# EAGLE design BBB_CNC_V2 (EAGLE 6.6.0)

## Sheet 1 of 4
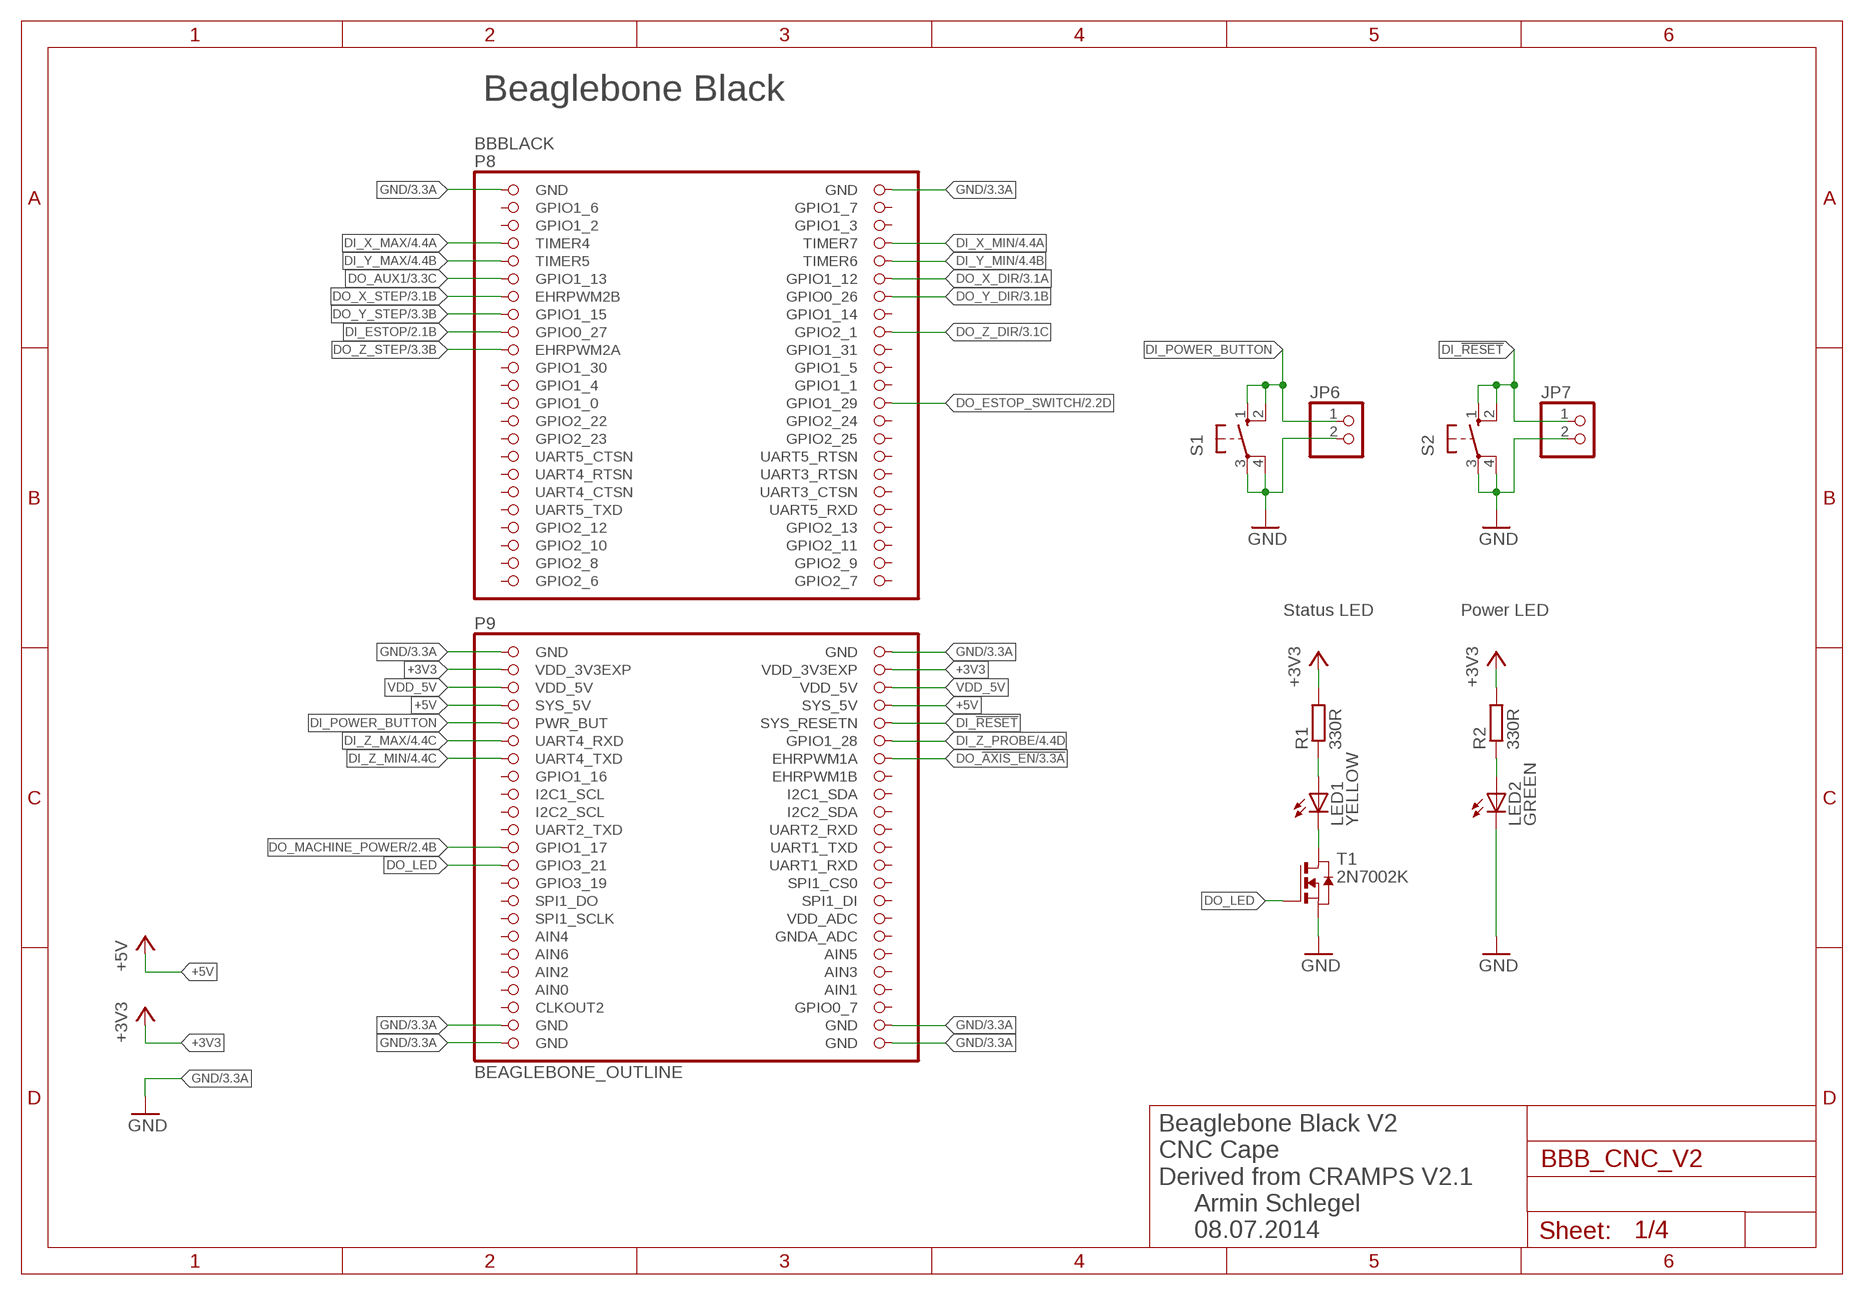
[diagram p0: schematic, sheet 1]

### Parts
BBBLACK  BEAGLEBONE_OUTLINE  [BEAGLEBONE_SHIELD]
JP6  PINHD-1X2  [1X02]
JP7  PINHD-1X2  [1X02]
LED1  YELLOW  LEDSML0805  [SML0805]
LED2  GREEN  LEDSML0805  [SML0805]
R1  330R  R-EU_R0603  [R0603]
R2  330R  R-EU_R0603  [R0603]
S1  10-XX  [B3F-10XX]
S2  10-XX  [B3F-10XX]
T1  2N7002K  NMOSSOT23  [SOT-23]

### Nets
+3V3: BBBLACK.49(VDD_3V3EXP) BBBLACK.50(VDD_3V3EXP) R1.2 R2.2 ; also sheet 2,4
+5V: BBBLACK.53(SYS_5V) BBBLACK.54(SYS_5V) ; also sheet 2,3
DI_!RESET: BBBLACK.56(SYS_RESETN) JP7.1 S2.1(S) S2.2(S1)
DI_ESTOP: BBBLACK.17(GPIO0_27) ; also sheet 2
DI_POWER_BUTTON: BBBLACK.55(PWR_BUT) JP6.1 S1.1(S) S1.2(S1)
DI_X_MAX: BBBLACK.7(TIMER4) ; also sheet 4
DI_X_MIN: BBBLACK.8(TIMER7) ; also sheet 4
DI_Y_MAX: BBBLACK.9(TIMER5) ; also sheet 4
DI_Y_MIN: BBBLACK.10(TIMER6) ; also sheet 4
DI_Z_MAX: BBBLACK.57(UART4_RXD) ; also sheet 4
DI_Z_MIN: BBBLACK.59(UART4_TXD) ; also sheet 4
DI_Z_PROBE: BBBLACK.58(GPIO1_28) ; also sheet 4
DO_!AXIS_EN: BBBLACK.60(EHRPWM1A) ; also sheet 3
DO_AUX1: BBBLACK.11(GPIO1_13) ; also sheet 3
DO_ESTOP_SWITCH: BBBLACK.26(GPIO1_29) ; also sheet 2
DO_LED: BBBLACK.71(GPIO3_21) T1.3(G)
DO_MACHINE_POWER: BBBLACK.69(GPIO1_17) ; also sheet 2
DO_X_DIR: BBBLACK.12(GPIO1_12) ; also sheet 3
DO_X_STEP: BBBLACK.13(EHRPWM2B) ; also sheet 3
DO_Y_DIR: BBBLACK.14(GPIO0_26) ; also sheet 3
DO_Y_STEP: BBBLACK.15(GPIO1_15) ; also sheet 3
DO_Z_DIR: BBBLACK.18(GPIO2_1) ; also sheet 3
DO_Z_STEP: BBBLACK.19(EHRPWM2A) ; also sheet 3
GND: BBBLACK.1(GND) BBBLACK.2(GND) BBBLACK.47(GND) BBBLACK.48(GND) BBBLACK.89(GND) BBBLACK.90(GND) BBBLACK.91(GND) BBBLACK.92(GND) JP6.2 JP7.2 LED2.C S1.3(P) S1.4(P1) S2.3(P) S2.4(P1) T1.2(S) ; also sheet 2,3,4
N$1: LED1.C T1.1(D)
N$2: LED1.A R1.1
N$3: LED2.A R2.1
VDD_5V: BBBLACK.51(VDD_5V) BBBLACK.52(VDD_5V)
Unconnected: BBBLACK.3(GPIO1_6) BBBLACK.4(GPIO1_7) BBBLACK.5(GPIO1_2) BBBLACK.6(GPIO1_3) BBBLACK.16(GPIO1_14) BBBLACK.20(GPIO1_31) BBBLACK.21(GPIO1_30) BBBLACK.22(GPIO1_5) BBBLACK.23(GPIO1_4) BBBLACK.24(GPIO1_1) BBBLACK.25(GPIO1_0) BBBLACK.27(GPIO2_22) BBBLACK.28(GPIO2_24) BBBLACK.29(GPIO2_23) BBBLACK.30(GPIO2_25) BBBLACK.31(UART5_CTSN) BBBLACK.32(UART5_RTSN) BBBLACK.33(UART4_RTSN) BBBLACK.34(UART3_RTSN) BBBLACK.35(UART4_CTSN) BBBLACK.36(UART3_CTSN) BBBLACK.37(UART5_TXD) BBBLACK.38(UART5_RXD) BBBLACK.39(GPIO2_12) BBBLACK.40(GPIO2_13) BBBLACK.41(GPIO2_10) BBBLACK.42(GPIO2_11) BBBLACK.43(GPIO2_8) BBBLACK.44(GPIO2_9) BBBLACK.45(GPIO2_6) BBBLACK.46(GPIO2_7) BBBLACK.61(GPIO1_16) BBBLACK.62(EHRPWM1B) BBBLACK.63(I2C1_SCL) BBBLACK.64(I2C1_SDA) BBBLACK.65(I2C2_SCL) BBBLACK.66(I2C2_SDA) BBBLACK.67(UART2_TXD) BBBLACK.68(UART2_RXD) BBBLACK.70(UART1_TXD) BBBLACK.72(UART1_RXD) BBBLACK.73(GPIO3_19) BBBLACK.74(SPI1_CS0) BBBLACK.75(SPI1_DO) BBBLACK.76(SPI1_DI) BBBLACK.77(SPI1_SCLK) BBBLACK.78(VDD_ADC) BBBLACK.79(AIN4) BBBLACK.80(GNDA_ADC) BBBLACK.81(AIN6) BBBLACK.82(AIN5) BBBLACK.83(AIN2) BBBLACK.84(AIN3) BBBLACK.86(AIN1) BBBLACK.87(CLKOUT2) BBBLACK.88(GPIO0_7)

### Notes on the sheet
- Beaglebone Black
- Status LED | Power LED
- Beaglebone Black V2
  CNC Cape
  Derived from CRAMPS V2.1
- Armin Schlegel
  08.07.2014

## Sheet 2 of 4
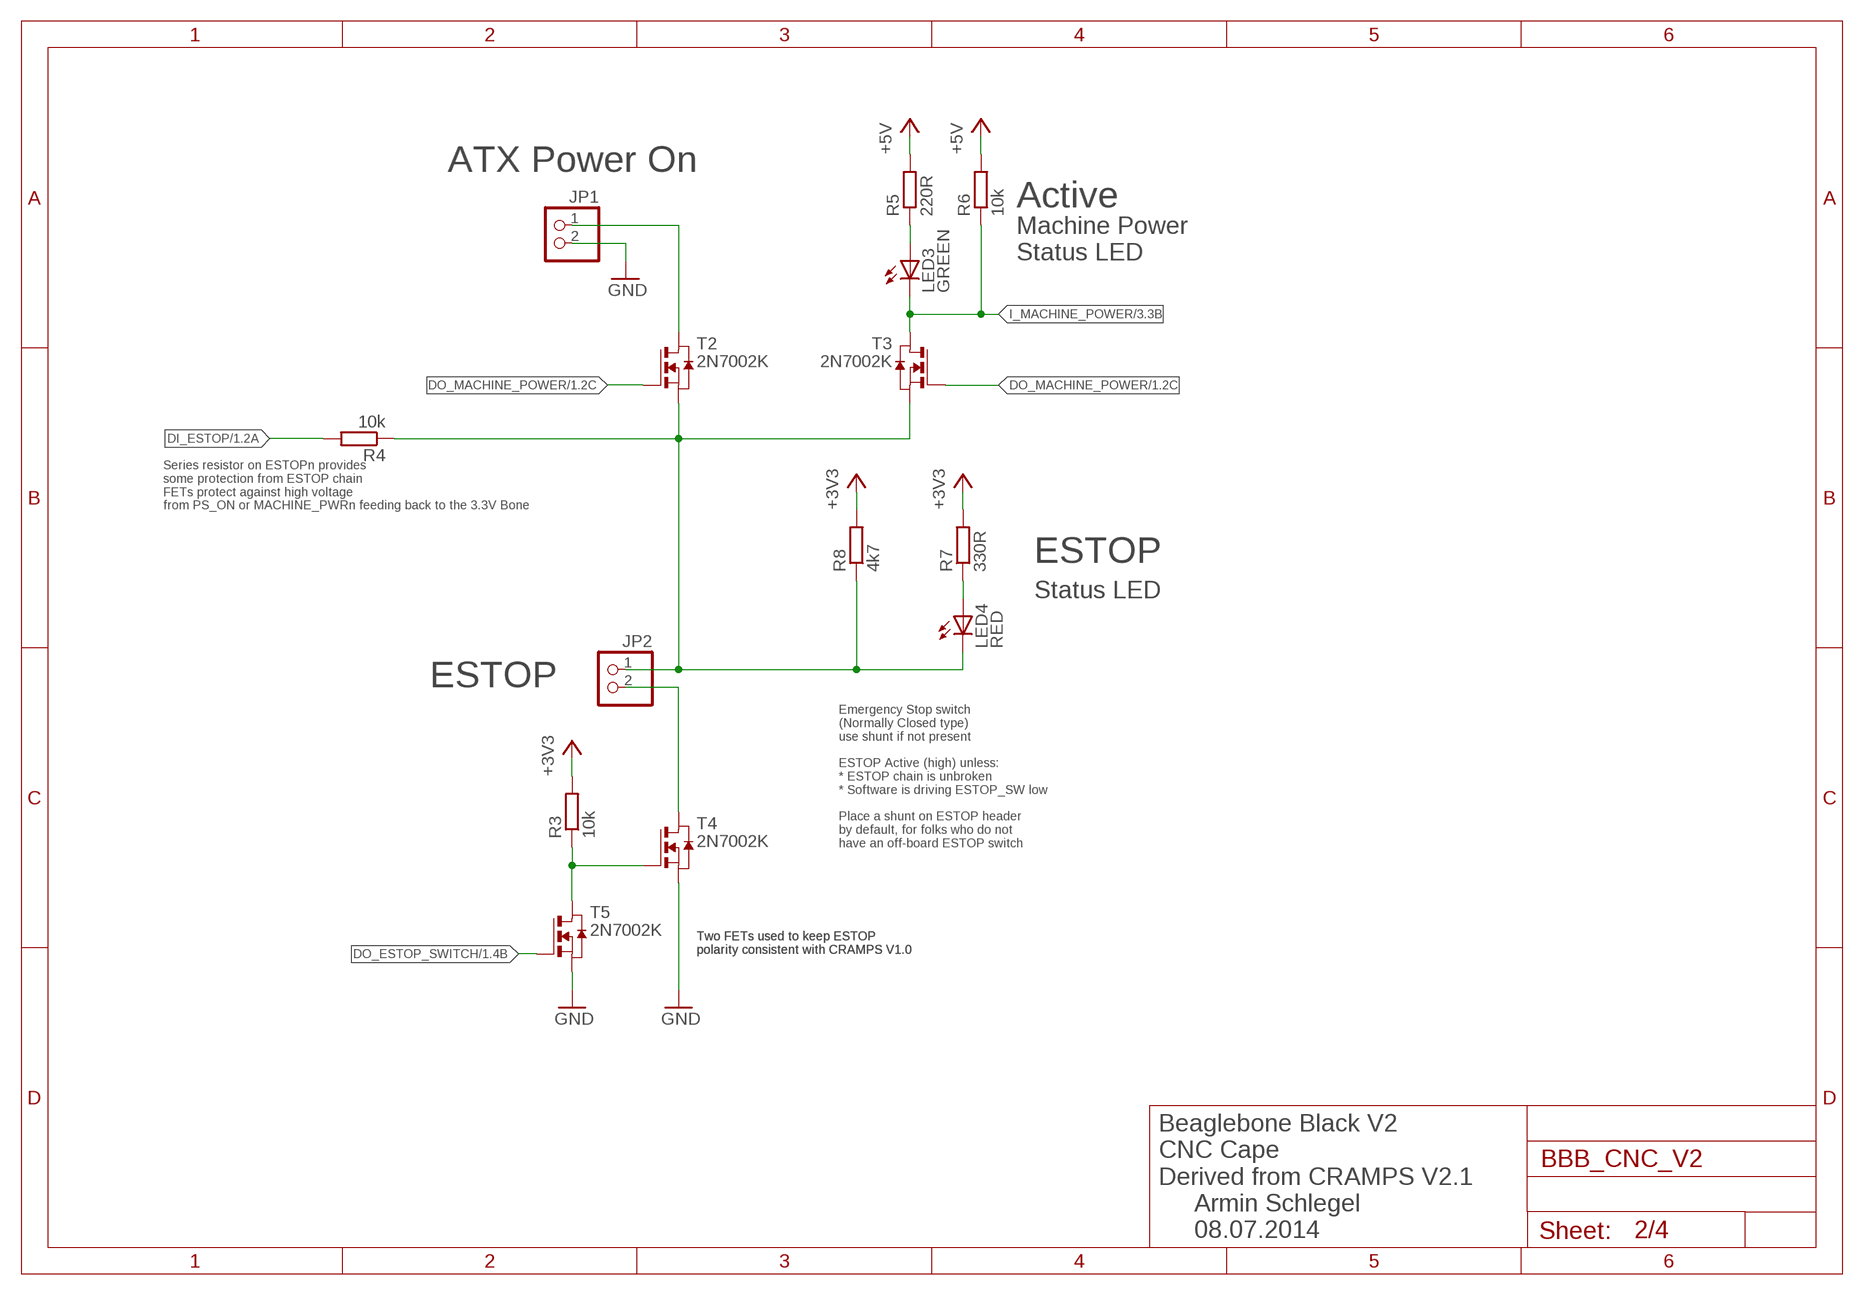
[diagram p1: schematic, sheet 2]

### Parts
JP1  PINHD-1X2  [1X02]
JP2  PINHD-1X2  [1X02]
LED3  GREEN  LEDSML0805  [SML0805]
LED4  RED  LEDSML0805  [SML0805]
R3  10k  R-EU_R0603  [R0603]
R4  10k  R-EU_R0603  [R0603]
R5  220R  R-EU_R0603  [R0603]
R6  10k  R-EU_R0603  [R0603]
R7  330R  R-EU_R0603  [R0603]
R8  4k7  R-EU_R0603  [R0603]
T2  2N7002K  NMOSSOT23  [SOT-23]
T3  2N7002K  NMOSSOT23  [SOT-23]
T4  2N7002K  NMOSSOT23  [SOT-23]
T5  2N7002K  NMOSSOT23  [SOT-23]

### Nets
+3V3: R3.2 R7.2 R8.2 ; also sheet 1,4
+5V: R5.2 R6.2 ; also sheet 1,3
DI_ESTOP: R4.2 ; also sheet 1
DO_ESTOP_SWITCH: T5.3(G) ; also sheet 1
DO_MACHINE_POWER: T2.3(G) T3.3(G) ; also sheet 1
GND: JP1.2 T4.2(S) T5.2(S) ; also sheet 1,3,4
I_MACHINE_POWER: LED3.C R6.1 T3.1(D) ; also sheet 3
I_MACHINE_POWER1: JP2.1 LED4.C R4.1 R8.1 T2.2(S) T3.2(S)
N$5: JP1.1 T2.1(D)
N$8: R3.1 T4.3(G) T5.1(D)
N$9: JP2.2 T4.1(D)
N$10: LED3.A R5.1
N$12: LED4.A R7.1

### Notes on the sheet
- ATX Power On
- Active
- Machine Power
  Status LED
- Series resistor on ESTOPn provides
  some protection from ESTOP chain
  FETs protect against high voltage
  from PS_ON or MACHINE_PWRn feeding back to the 3.3V Bone
- ESTOP
- Status LED
- ESTOP
- Emergency Stop switch
  (Normally Closed type)
  use shunt if not present
- ESTOP Active (high) unless:
  * ESTOP chain is unbroken
  * Software is driving ESTOP_SW low
- Place a shunt on ESTOP header
  by default, for folks who do not
  have an off-board ESTOP switch
- Two FETs used to keep ESTOP
  polarity consistent with CRAMPS V1.0
- Two FETs used to keep ESTOP
  polarity consistent with CRAMPS V1.0
- Beaglebone Black V2
  CNC Cape
  Derived from CRAMPS V2.1
- Armin Schlegel
  08.07.2014

## Sheet 3 of 4
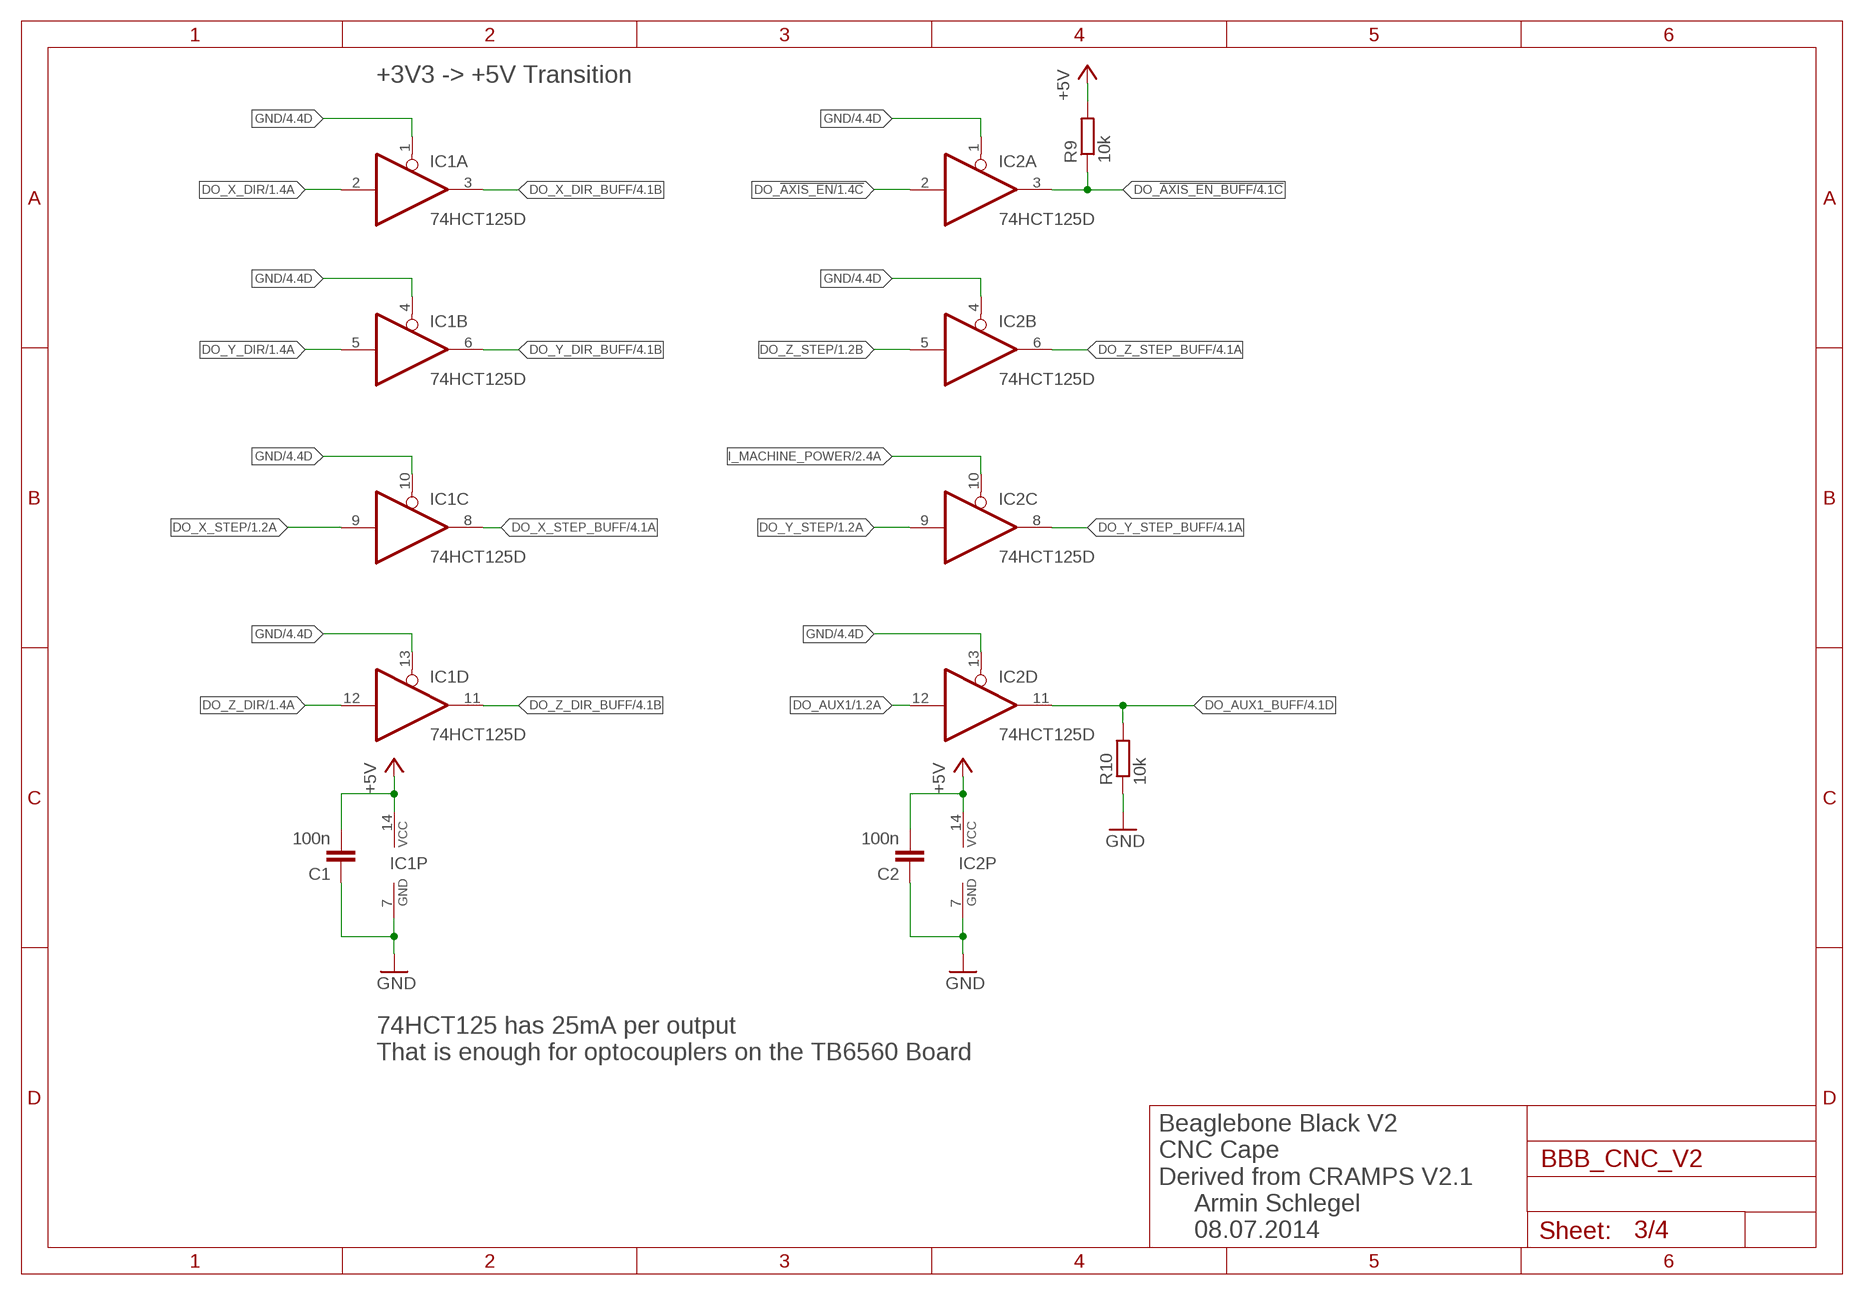
[diagram p2: schematic, sheet 3]

### Parts
C1  100n  C-EUC0603K  [C0603K]
C2  100n  C-EUC0603K  [C0603K]
IC1  74HCT125D  [SO14]
IC2  74HCT125D  [SO14]
R9  10k  R-EU_R0603  [R0603]
R10  10k  R-EU_R0603  [R0603]

### Nets
+5V: C1.2 C2.2 IC1.14(P:VCC) IC2.14(P:VCC) R9.2 ; also sheet 1,2
DO_!AXIS_EN: IC2.2(A:I) ; also sheet 1
DO_!AXIS_EN_BUFF: IC2.3(A:O) R9.1 ; also sheet 4
DO_AUX1: IC2.12(D:I) ; also sheet 1
DO_AUX1_BUFF: IC2.11(D:O) R10.2 ; also sheet 4
DO_X_DIR: IC1.2(A:I) ; also sheet 1
DO_X_DIR_BUFF: IC1.3(A:O) ; also sheet 4
DO_X_STEP: IC1.9(C:I) ; also sheet 1
DO_X_STEP_BUFF: IC1.8(C:O) ; also sheet 4
DO_Y_DIR: IC1.5(B:I) ; also sheet 1
DO_Y_DIR_BUFF: IC1.6(B:O) ; also sheet 4
DO_Y_STEP: IC2.9(C:I) ; also sheet 1
DO_Y_STEP_BUFF: IC2.8(C:O) ; also sheet 4
DO_Z_DIR: IC1.12(D:I) ; also sheet 1
DO_Z_DIR_BUFF: IC1.11(D:O) ; also sheet 4
DO_Z_STEP: IC2.5(B:I) ; also sheet 1
DO_Z_STEP_BUFF: IC2.6(B:O) ; also sheet 4
GND: C1.1 C2.1 IC1.1(A:OE) IC1.4(B:OE) IC1.7(P:GND) IC1.10(C:OE) IC1.13(D:OE) IC2.1(A:OE) IC2.4(B:OE) IC2.7(P:GND) IC2.13(D:OE) R10.1 ; also sheet 1,2,4
I_MACHINE_POWER: IC2.10(C:OE) ; also sheet 2

### Notes on the sheet
- +3V3 -> +5V Transition
- 74HCT125 has 25mA per output
  That is enough for optocouplers on the TB6560 Board
- Beaglebone Black V2
  CNC Cape
  Derived from CRAMPS V2.1
- Armin Schlegel
  08.07.2014

## Sheet 4 of 4
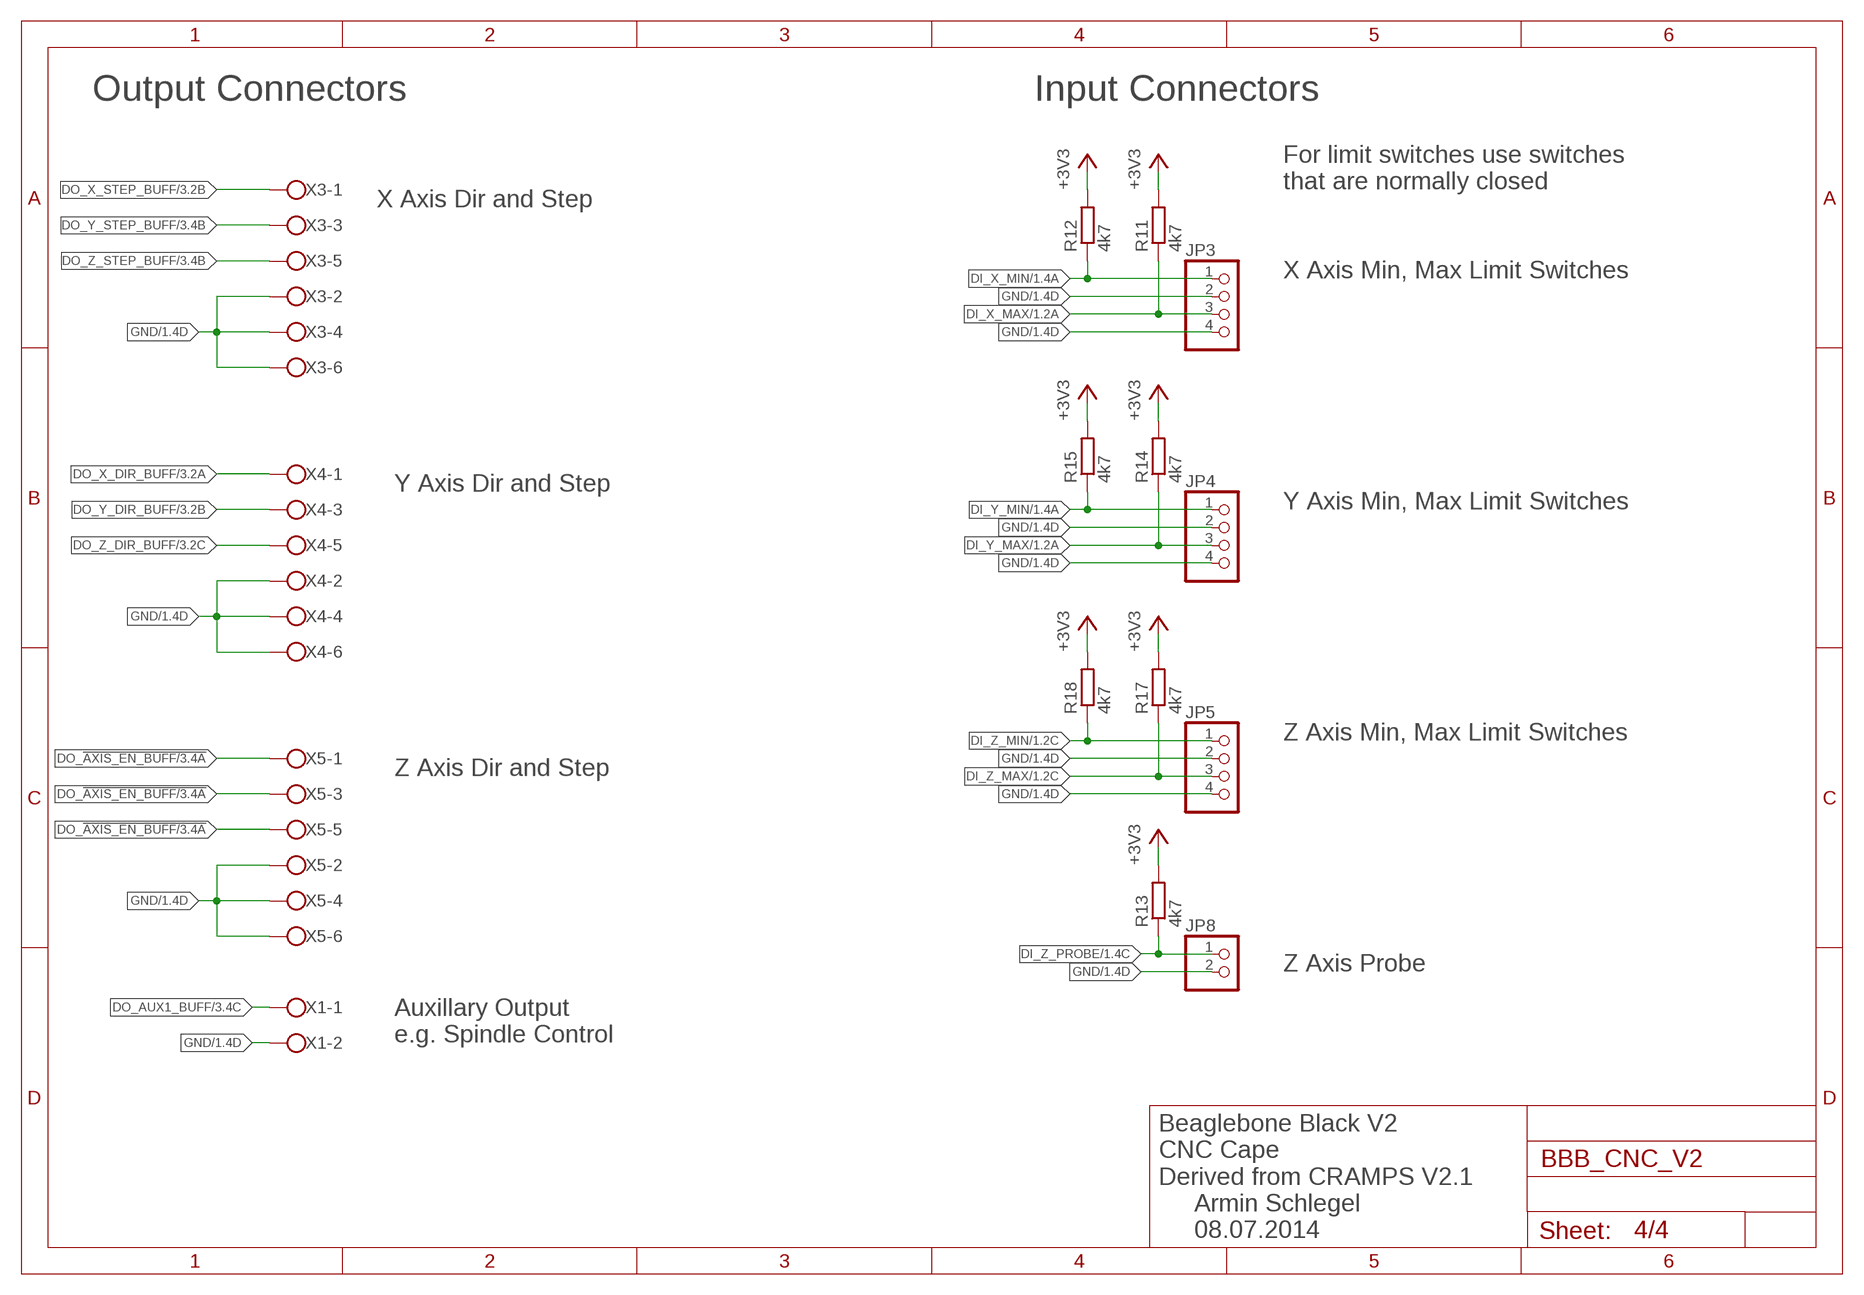
[diagram p3: schematic, sheet 4]

### Parts
JP3  PINHD-1X4  [1X04]
JP4  PINHD-1X4  [1X04]
JP5  PINHD-1X4  [1X04]
JP8  PINHD-1X2  [1X02]
R11  4k7  R-EU_R0603  [R0603]
R12  4k7  R-EU_R0603  [R0603]
R13  4k7  R-EU_R0603  [R0603]
R14  4k7  R-EU_R0603  [R0603]
R15  4k7  R-EU_R0603  [R0603]
R17  4k7  R-EU_R0603  [R0603]
R18  4k7  R-EU_R0603  [R0603]
X1  W237-102  [W237-102]
X3  W237-136  [W237-136]
X4  W237-136  [W237-136]
X5  W237-136  [W237-136]

### Nets
+3V3: R11.2 R12.2 R13.2 R14.2 R15.2 R17.2 R18.2 ; also sheet 1,2
DI_X_MAX: JP3.3 R11.1 ; also sheet 1
DI_X_MIN: JP3.1 R12.1 ; also sheet 1
DI_Y_MAX: JP4.3 R14.1 ; also sheet 1
DI_Y_MIN: JP4.1 R15.1 ; also sheet 1
DI_Z_MAX: JP5.3 R17.1 ; also sheet 1
DI_Z_MIN: JP5.1 R18.1 ; also sheet 1
DI_Z_PROBE: JP8.1 R13.1 ; also sheet 1
DO_!AXIS_EN_BUFF: X5.1 X5.3 X5.5 ; also sheet 3
DO_AUX1_BUFF: X1.1 ; also sheet 3
DO_X_DIR_BUFF: X4.1 ; also sheet 3
DO_X_STEP_BUFF: X3.1 ; also sheet 3
DO_Y_DIR_BUFF: X4.3 ; also sheet 3
DO_Y_STEP_BUFF: X3.3 ; also sheet 3
DO_Z_DIR_BUFF: X4.5 ; also sheet 3
DO_Z_STEP_BUFF: X3.5 ; also sheet 3
GND: JP3.2 JP3.4 JP4.2 JP4.4 JP5.2 JP5.4 JP8.2 X1.2 X3.2 X3.4 X3.6 X4.2 X4.4 X4.6 X5.2 X5.4 X5.6 ; also sheet 1,2,3

### Notes on the sheet
- Output Connectors | Input Connectors
- For limit switches use switches 
  that are normally closed
- X Axis Dir and Step
- X Axis Min, Max Limit Switches
- Y Axis Dir and Step
- Y Axis Min, Max Limit Switches
- Z Axis Min, Max Limit Switches
- Z Axis Dir and Step
- Z Axis Probe
- Auxillary Output
  e.g. Spindle Control
- Beaglebone Black V2
  CNC Cape
  Derived from CRAMPS V2.1
- Armin Schlegel
  08.07.2014

## Power pins joined to a net without a drawn wire
AIN0: BBBLACK.85(AIN0)

## Library data of the parts
BBBLACK = adafruit:BEAGLEBONE_OUTLINE: Should match A3 pinout - but not completely tested
C1 C2 = rcl:C-EU: CAPACITOR, European symbol
IC1 IC2 = 74xx-eu:74*125: Quad bus BUFFER, 3-state
JP1 JP2 JP6-JP8 = pinhead:PINHD-1X2: PIN HEADER
JP3-JP5 = pinhead:PINHD-1X4: PIN HEADER
LED1-LED4 = led:LED: LED OSRAM: - CHIPLED LG R971, LG N971, LY N971, LG Q971, LY Q971, LO R971, LY R971 LH N974, LH R974 LS Q976, LO Q976, LY Q976 LO Q996 - Hyper CHIPLED LW Q18S LB Q993, LB Q99A, LB R99A - SideLED LS A670, LO A670, LY A670, LG A670, LP A670 LB A673, LV A673, LT A673, LW A673 LH A674 LY A675 LS A676, LA A676, LO A676, LY A676, LW A676 LS A679, LY A679, LG A679 - Hyper Micro SIDELED® LS Y876, LA Y876, LO Y876, LY Y876 LT Y87S - SmartLED LW L88C, LW L88S LB L89C, LB L89S, LG L890 LS L89K, LO L89K, LY L89K LS L896, LA L896, LO L896, LY L896 - TOPLED LS T670, LO T670, LY T670, LG T670, LP T670 LSG T670, LSP T670, LSY T670, LOP T670, LYG T670 LG T671, LOG T671, LSG T671 LB T673, LV T673, LT T673, LW T673 LH T674 LS T676, LA T676, LO T676, LY T676, LB T676, LH T676, LSB T676, LW T676 LB T67C, LV T67C, LT T67C, LS T67K, LO T67K, LY T67K, LW E67C LS E67B, LA E67B, LO E67B, LY E67B, LB E67C, LV E67C, LT E67C LW T67C LS T679, LY T679, LG T679 LS T770, LO T770, LY T770, LG T770, LP T770 LB T773, LV T773, LT T773, LW T773 LH T774 LS E675, LA E675, LY E675, LS T675 LS T776, LA T776, LO T776, LY T776, LB T776 LHGB T686 LT T68C, LB T68C - Hyper Mini TOPLED® LB M676 - Mini TOPLED Santana® LG M470 LS M47K, LO M47K, LY M47K Source: http://www.osram.convergy.de LUXEON: - LUMILED® LXK2-PW12-R00, LXK2-PW12-S00, LXK2-PW14-U00, LXK2-PW14-V00 LXK2-PM12-R00, LXK2-PM12-S00, LXK2-PM14-U00 LXK2-PE12-Q00, LXK2-PE12-R00, LXK2-PE12-S00, LXK2-PE14-T00, LXK2-PE14-U00 LXK2-PB12-K00, LXK2-PB12-L00, LXK2-PB12-M00, LXK2-PB14-N00, LXK2-PB14-P00, LXK2-PB14-Q00 LXK2-PR12-L00, LXK2-PR12-M00, LXK2-PR14-Q00, LXK2-PR14-R00 LXK2-PD12-Q00, LXK2-PD12-R00, LXK2-PD12-S00 LXK2-PH12-R00, LXK2-PH12-S00 LXK2-PL12-P00, LXK2-PL12-Q00, LXK2-PL12-R00 Source: www.luxeon.com KINGBRIGHT: KA-3528ASYC Source: www.kingbright.com
R1-R15 R17 R18 = rcl:R-EU_: RESISTOR, European symbol
S1 S2 = switch-omron:10-XX: OMRON SWITCH; MPN: B3F-1000; OC_FARNELL: 176432; OC_NEWARK: 36M3542
T1-T5 = zetex:NMOSSOT23: MOS FET; OC_FARNELL: unknown; OC_NEWARK: unknown
X1 = con-wago-500:W237-102: WAGO SCREW CLAMP; MPN: 237-102; OC_FARNELL: unknown; OC_NEWARK: 70K9898
X3-X5 = con-wago-500:W237-136: WAGO SCREW CLAMP; MPN: 237-136; OC_FARNELL: unknown; OC_NEWARK: 84K9151

## Board
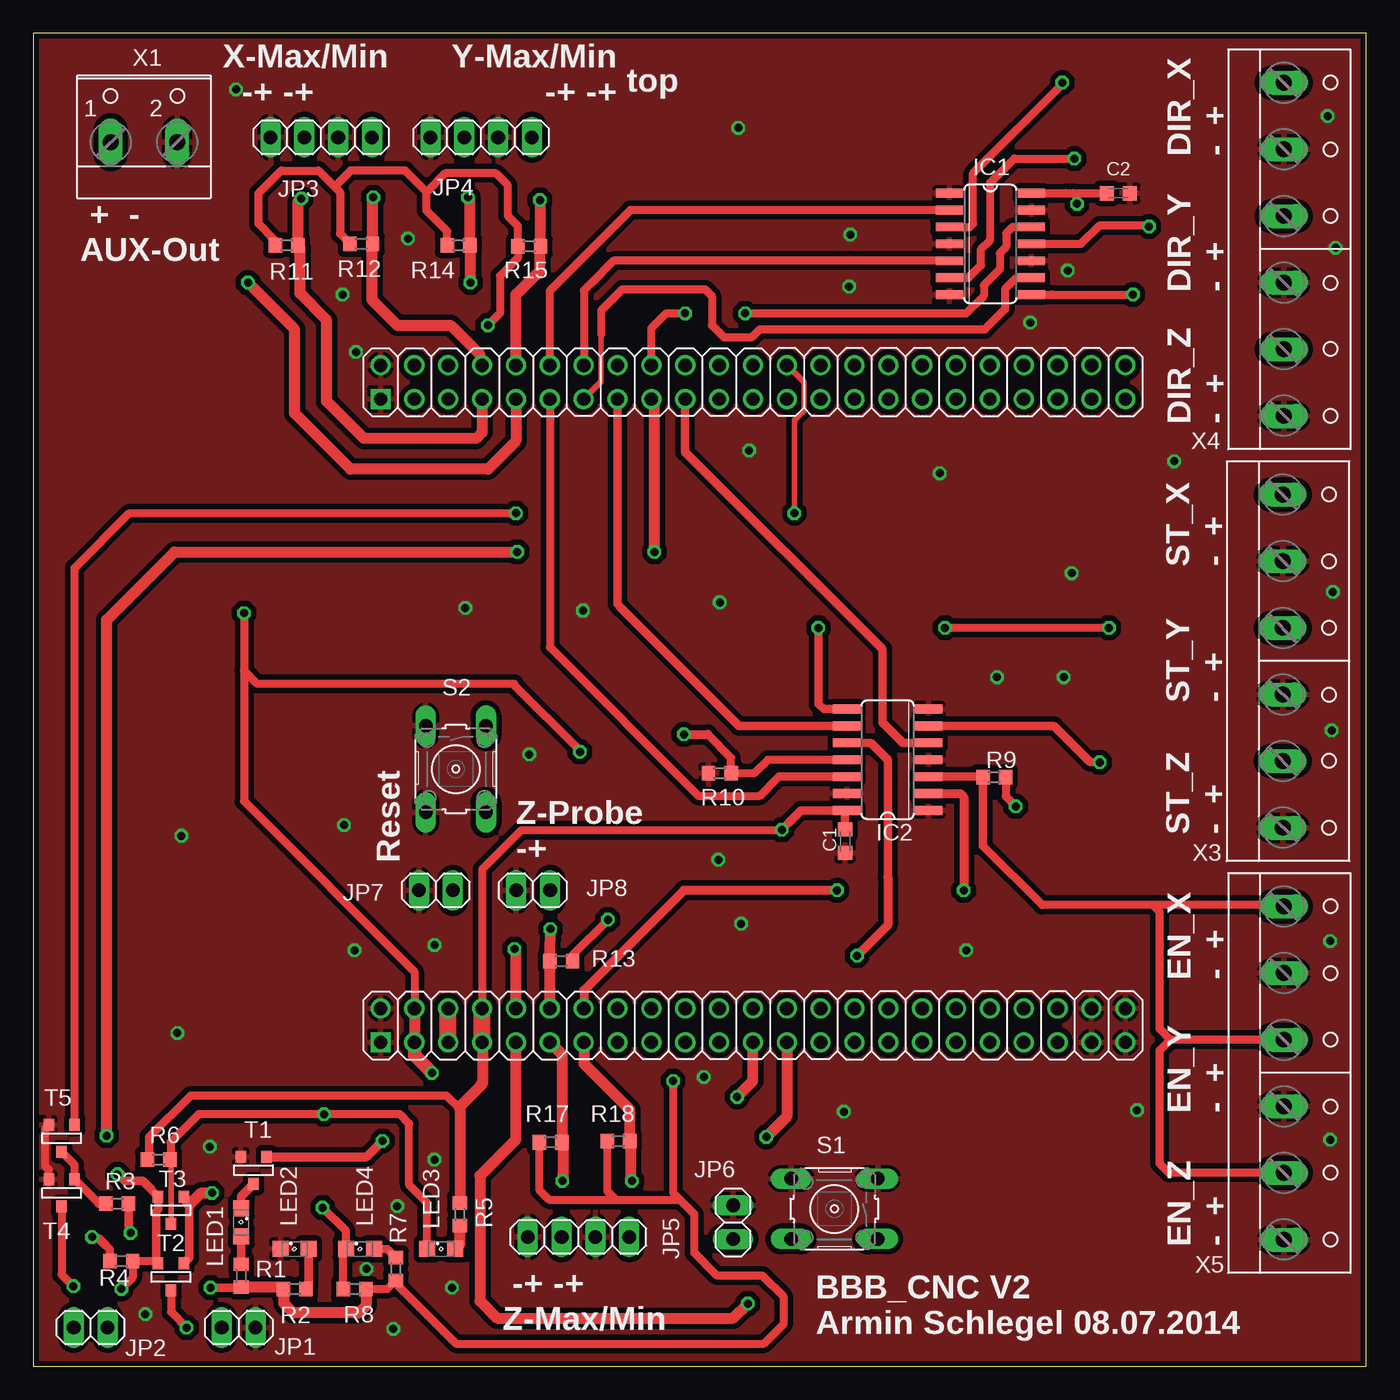
[diagram p4: board, top side]
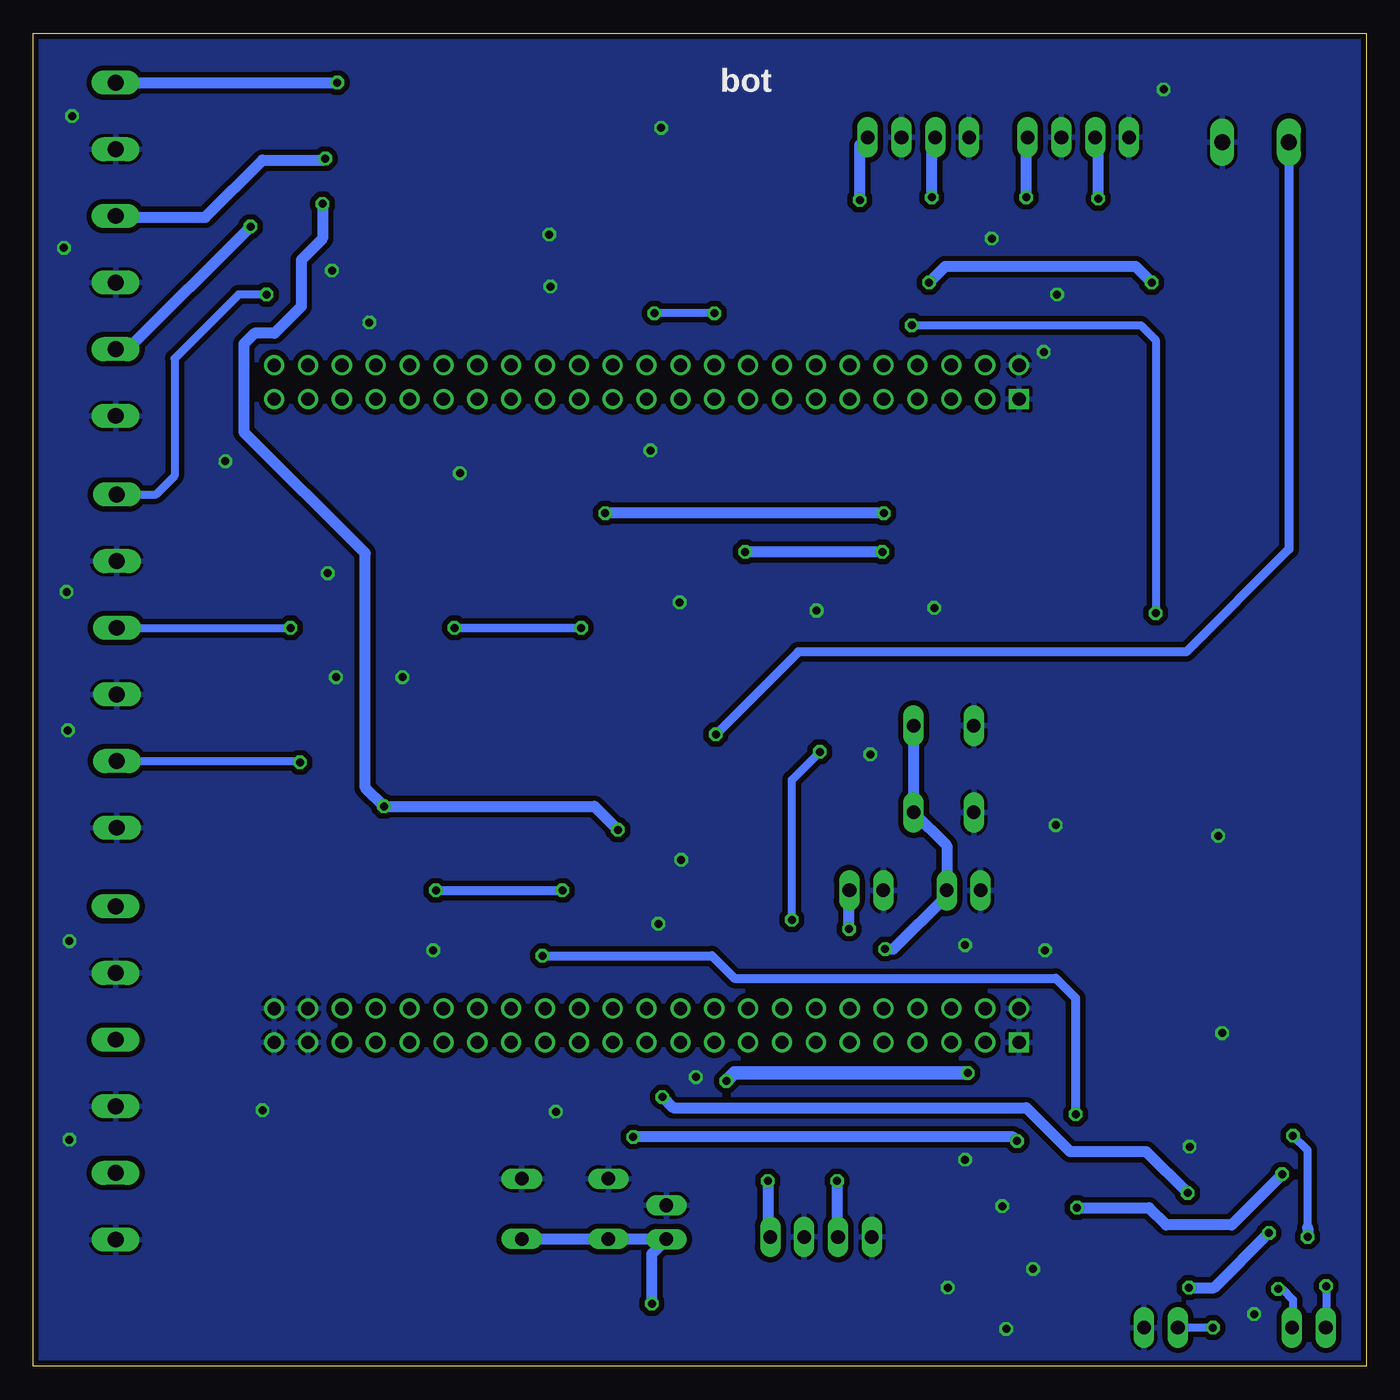
[diagram p5: board, bottom side, seen from below]

Size 100 x 100 mm. Coordinates in mm from the lower left corner, seen from the top.
Outline: 0,0 100,0 100,100 0,100 0,0
Copper layers (1*16): Top 0.035mm / dielectric 1.5mm / Bottom 0.035mm
Design rules "ITEADstudio_DRC": minimum track width 6mil, minimum drill 12mil, track to track 6mil, track to pad 6mil, pad to pad 6mil, via to via 6mil, smd to smd 0mil, copper to edge 10mil, drill to drill 10mil, minimum pad ring 10mil, minimum via ring 6mil, stop-mask expansion 2mil, vias tented up to drill 100mil, thermal gap 10mil

### Footprints (pad centres in the part's own frame; a part is rotated, then mirrored left to right if it is on the bottom)
BEAGLEBONE_SHIELD = drill 1 square: 1 4.445,19.05; 47 52.705,19.05 | drill 1: 2 1.905,19.05; 3 4.445,21.59; 4 1.905,21.59; 5 4.445,24.13; 6 1.905,24.13; 7 4.445,26.67; 8 1.905,26.67; 9 4.445,29.21; 10 1.905,29.21; 11 4.445,31.75; 12 1.905,31.75; 13 4.445,34.29; 14 1.905,34.29; 15 4.445,36.83; 16 1.905,36.83; 17 4.445,39.37; 18 1.905,39.37; 19 4.445,41.91; 20 1.905,41.91; 21 4.445,44.45; 22 1.905,44.45; 23 4.445,46.99; 24 1.905,46.99; 25 4.445,49.53; 26 1.905,49.53; 27 4.445,52.07; 28 1.905,52.07; 29 4.445,54.61; 30 1.905,54.61; 31 4.445,57.15; 32 1.905,57.15; 33 4.445,59.69; 34 1.905,59.69; 35 4.445,62.23; 36 1.905,62.23; 37 4.445,64.77; 38 1.905,64.77; 39 4.445,67.31; 40 1.905,67.31; 41 4.445,69.85; 42 1.905,69.85; 43 4.445,72.39; 44 1.905,72.39; 45 4.445,74.93; 46 1.905,74.93; 48 50.165,19.05; 49 52.705,21.59; 50 50.165,21.59; 51 52.705,24.13; 52 50.165,24.13; 53 52.705,26.67; 54 50.165,26.67; 55 52.705,29.21; 56 50.165,29.21; 57 52.705,31.75; 58 50.165,31.75; 59 52.705,34.29; 60 50.165,34.29; 61 52.705,36.83; 62 50.165,36.83; 63 52.705,39.37; 64 50.165,39.37; 65 52.705,41.91; 66 50.165,41.91; 67 52.705,44.45; 68 50.165,44.45; 69 52.705,46.99; 70 50.165,46.99; 71 52.705,49.53; 72 50.165,49.53; 73 52.705,52.07; 74 50.165,52.07; 75 52.705,54.61; 76 50.165,54.61; 77 52.705,57.15; 78 50.165,57.15; 79 52.705,59.69; 80 50.165,59.69; 81 52.705,62.23; 82 50.165,62.23; 83 52.705,64.77; 84 50.165,64.77; 85 52.705,67.31; 86 50.165,67.31; 87 52.705,69.85; 88 50.165,69.85; 89 52.705,72.39; 90 50.165,72.39; 91 52.705,74.93; 92 50.165,74.93
C0603K = smd 1.05 x 1.08: 1 -0.875,0; 2 0.875,0
SO14 = smd 0.66 x 2.032: 1 -3.81,-3.073; 2 -2.54,-3.073; 3 -1.27,-3.073; 4 0,-3.073; 5 1.27,-3.073; 6 2.54,-3.073; 7 3.81,-3.073; 8 3.81,3.073; 9 2.54,3.073; 10 1.27,3.073; 11 0,3.073; 12 -1.27,3.073; 13 -2.54,3.073; 14 -3.81,3.073
1X02 = drill 1.016 long: 1 -1.27,0; 2 1.27,0
1X04 = drill 1.016 long: 1 -3.81,0; 2 -1.27,0; 3 1.27,0; 4 3.81,0
SML0805 = smd 1.2 x 1.2: A 1.05,0; C -1.05,0
R0603 = smd 1 x 1.1: 1 -0.85,0; 2 0.85,0
B3F-10XX = drill 1.016 long: 1 -3.251,2.261; 2 3.251,2.261; 3 -3.251,-2.261; 4 3.251,-2.261
SOT-23 = smd 0.787 x 0.889: 1 0.025,-1.016; 2 -0.94,1.016; 3 0.991,1.016
W237-102 = drill 1.194 long: 1 -2.5,-1.27; 2 2.5,-1.27
W237-136 = drill 1.194 long: 1 -12.5,-1.27; 2 -7.5,-1.27; 3 -2.5,-1.27; 4 2.5,-1.27; 5 7.5,-1.27; 6 12.5,-1.27

### Placement (x,y rotation side)
BBBLACK  7,77 270 top
C1  60.9,39.4 90 top
C2  81.4,88 180 top
IC1  71.8,84.2 270 top
IC2  64.1,45.5 90 top
JP1  15.4,2.9 0 top
JP2  4.3,2.9 180 top
JP3  21.6,92.2 180 top
JP4  33.6,92.2 180 top
JP5  40.9,9.7 180 top
JP6  52.5,10.8 90 top
JP7  30.2,35.7 180 top
JP8  37.5,35.7 180 top
LED1  15.6,10.8 270 top
LED2  19.6,8.8 0 top
LED3  30.6,8.8 0 top
LED4  24.5,8.8 0 top
R1  15.6,6.8 270 top
R2  19.6,5.8 180 top
R3  6.3,12.2 0 top
R4  6.6,7.9 180 top
R5  32,11.4 90 top
R6  9.4,15.5 180 top
R7  27.2,7.3 270 top
R8  24.1,5.8 0 top
R9  72.1,44.2 0 top
R10  51.5,44.5 0 top
R11  19,84.1 180 top
R12  24.6,84.2 180 top
R13  39.6,30.4 0 top
R14  31.9,84.1 180 top
R15  37.2,84 180 top
R17  38.8,16.8 180 top
R18  43.9,16.9 180 top
S1  60.1,11.8 180 top
S2  31.7,44.8 270 top
T1  16.5,14.7 0 top
T2  10.3,6.7 0 top
T3  10.3,11.7 0 top
T4  2.1,13 0 top
T5  2.1,17.1 0 top
X1  8.3,93.1 0 top
X3  95,52.9 270 top
X4  95.1,83.8 270 top
X5  95.1,22 270 top

### Tracks (layer width: path | path; a pad name or v marks a point on that pad's centre or on a via)
+3V3  (via drill 0.6 pad 1.02)
  Top 0.61: R11.2 18.15,84.45 16.9,85.7 16.9,88 18.6,89.7 21.4,89.7 22.6,88.5 | 22.6,88.5 23,88.1 23,84.95 R12.2 | 29.5,88.1 27.9,89.7 23.8,89.7 22.6,88.5 | 29.5,88.1 30.9,89.5 34.7,89.5 35.6,88.6 35.6,86.3 36.35,85.55 R15.2 36.35,83.15 35,81.8 35,79 v34.1,78.1 | R14.2 31.05,85.15 29.5,86.7 29.5,88.1 | v15.8,56.5 15.8,52.2 | 15.8,52.2 15.8,42.4 28.6,29.6 BBBLACK.50 | R13.2 40.45,30.85 v43.1,33.5 | 36.1,51.2 36,51.2 | 36,51.2 16.8,51.2 15.8,52.2 | v41,46.1 41,46.2 36,51.2 | v48,21.4 48,13 48.5,12.5 | R8.2 26.55,5.8 R7.2 27.2,6.2 31.7,1.7 54.8,1.7 56.3,3.2 56.3,5.2 54.7,6.8 51.3,6.8 49.6,8.5 49.6,11.4 48.5,12.5 | R17.2 37.95,13.25 38.7,12.5 43.7,12.5 | 43.7,12.5 48.5,12.5 | R18.2 43.05,13.15 43.7,12.5
  Top 0.65: v13.3,5.9 15.55,5.9 R1.2 | R3.2 7.15,10.15 v7.3,10
  Top 0.813: BBBLACK.50 BBBLACK.49 | R1.2 18.6,5.95 R2.2 18.8,5.75 18.8,4.7 19.5,4 24.4,4 24.95,4.55 R8.2
  Top 1.016: BBBLACK.49 28.59,23.31 v29.9,22
  Bottom 0.61: v34.1,78.1 16.9,78.1 15.8,77 v15.8,56.5 | v43.1,33.5 43.1,44 v41,46.1
  Bottom 0.813: v13.3,5.9 11.4,5.9 v7.3,10
  Bottom 1.016: v29.9,22 47.4,22 v48,21.4
+5V  (via drill 0.6 pad 1.02)
  Top 0.61: 61.02,41.7 IC2.14 | 33.7,26.86 33.7,37.3 36.6,40.2 56.1,40.2 v56.15,40.25 | R9.2 72.95,42.75 v73.7,42 | 78,88.01 IC1.14 77.49,88.01 | 78,88.01 80.52,88.01 C2.2 | 32,19.3 31,20.3 11.8,20.3 8.7,17.2 | 56.2,40.3 56.65,40.75 | v78.3,87.2 78.3,87.71 78,88.01
  Top 0.65: 61.02,41.7 57.6,41.7 56.65,40.75 v56.15,40.25 | 33.7,26.86 BBBLACK.54 | C1.2 60.9,41.56 IC2.14 | 33.7,24.27 BBBLACK.53 | 8.7,17.2 8.7,15.65 R6.2
  Top 0.813: 33.7,24.27 33.7,21.3 | 33.7,21.3 33.7,21.2 32,19.5 32,19.3 R5.2 | 33.6,21.2 33.7,21.3
  Top 1.27: BBBLACK.53 BBBLACK.54
  Bottom 0.813: v56.15,40.25 57.9,42 v73.7,42 75.1,43.4 75.1,61 84.2,70.1 84.2,76.7 83.4,77.5 81.9,77.5 79.9,79.5 79.9,83 78.3,84.6 v78.3,87.2
DI_!RESET  (via drill 0.6 pad 1.02)
  Top 0.813: BBBLACK.56 36.21,31.19 v36.1,31.3
  Bottom 0.813: S2.1 S2.2 31.47,39.06 JP7.1 31.47,35.3 35.47,31.3 v36.1,31.3
DI_ESTOP  (via drill 0.6 pad 1.02)
  Top 0.61: R4.2 5.75,8.75 5.45,9.05
  Top 0.65: 5.45,9.05 4.9,9.6 4.5,9.6 v4.4,9.7
  Top 0.813: v5.5,17.3 5.5,56 10.6,61.1 v36.3,61.1 | v46.6,61.1 46.6,72.33 BBBLACK.17
  Bottom 0.61: 4.4,10.4 4.4,16.2 v5.5,17.3
  Bottom 0.813: v36.3,61.1 v46.6,61.1 | 4.4,10.4 v4.4,9.7
DI_POWER_BUTTON  (via drill 0.6 pad 1.02)
  Top 0.813: BBBLACK.55 36.21,17.01 33.5,14.3 33.5,4.9 34.8,3.6 52.5,3.6 v53.6,4.7
  Bottom 0.813: 56.84,9.53 S1.2 | 56.84,9.53 JP6.1 53.6,8.43 v53.6,4.7 | 56.84,9.53 S1.1
DI_X_MAX  (via drill 0.6 pad 1.02)
  Top 0.813: BBBLACK.7 33.67,70.07 33.2,69.6 24.8,69.6 22,72.4 22,78.5 20,80.5 20,83.95 R11.1 19.85,87.35 v20.1,87.6
  Bottom 0.813: v20.1,87.6 20.1,91.97 JP3.3
DI_X_MIN  (via drill 0.6 pad 1.02)
  Top 0.813: v25.5,87.7 25.45,87.65 R12.1 25.4,84.15 25.4,80 27.3,78.1 31.3,78.1 33.5,75.9 33.5,75.27 BBBLACK.8
  Bottom 0.813: v25.5,87.7 25.5,92.11 JP3.1
DI_Y_MAX  (via drill 0.6 pad 1.02)
  Top 0.813: v32.6,87.7 32.75,87.55 R14.1 32.8,84.05 v32.8,81.3 | BBBLACK.9 36.21,69.41 34.1,67.3 23.8,67.3 19.6,71.5 19.6,77.8 v16.1,81.3
  Bottom 0.813: v32.6,87.7 32.6,91.93 JP4.3 | v16.1,81.3 17.3,82.5 31.6,82.5 v32.8,81.3
DI_Y_MIN  (via drill 0.6 pad 1.02)
  Top 0.813: BBBLACK.10 36.21,80.41 38,82.2 38,83.95 R15.1 38.05,87.45 v38,87.5
  Bottom 0.813: v38,87.5 38,91.61 JP4.1
DI_Z_MAX  (via drill 0.6 pad 1.02)
  Top 0.65: 39.73,16.72 R17.1
  Top 0.813: 39.73,16.72 39.73,14.33 v39.7,13.9 | BBBLACK.57 39.65,23.39 R17.1
  Bottom 0.813: v39.7,13.9 39.7,9.77 JP5.3
DI_Z_MIN  (via drill 0.6 pad 1.02)
  Top 0.65: 44.81,16.84 R18.1
  Top 0.813: 44.81,16.84 44.81,14.09 v44.9,13.9 | R18.1 44.75,19.25 41.3,22.7 41.3,24.29 BBBLACK.59
  Bottom 0.813: v44.9,13.9 44.9,9.89 JP5.1
DI_Z_PROBE  (via drill 0.6 pad 1.02)
  Top 0.813: BBBLACK.58 R13.1 38.75,30.95 v38.8,32.8
  Bottom 0.813: v38.8,32.8 38.8,35.67 JP8.1
DO_!AXIS_EN  (via drill 0.6 pad 1.02)
  Top 0.68: IC2.2 69.54,42.96 69.8,42.7 v69.8,35.7 | v60.3,35.7 48.8,35.7 41.3,28.2 BBBLACK.60
  Bottom 0.68: v69.8,35.7 v60.3,35.7
DO_!AXIS_EN_BUFF
  Top 0.61: 71.25,39.05 75.7,34.6 84,34.6 | X5.1 93.73,34.6 84,34.6 | X5.3 85.3,24.5 | 85.3,24.5 84.5,25.3 84.5,34.1 84,34.6 | X5.5 85.2,14.5 84.5,15.2 84.5,23.7 85.3,24.5
  Top 0.65: IC2.3 71.22,44.23 R9.1 71.25,39.05
DO_AUX1
  Top 0.61: BBBLACK.11 38.75,53.95 49.9,42.8 54.5,42.8 55.93,44.23
  Top 0.65: IC2.12 55.93,44.23
DO_AUX1_BUFF  (via drill 0.6 pad 1.02)
  Top 0.61: 50.6,47.4 52.35,45.65 R10.2 54.1,44.5 55.1,45.5 IC2.11
  Top 0.68: v48.8,47.4 50.6,47.4
  Bottom 0.68: X1.1 5.8,61.3 13.5,53.6 42.6,53.6 v48.8,47.4
DO_ESTOP_SWITCH  (via drill 0.6 pad 1.02)
  Top 0.406: v57.1,64 57.1,71 57.8,71.7 57.8,73.83 BBBLACK.26
  Top 0.61: T5.3 3.09,59.89 7.2,64 v36.2,64
  Top 0.813: 36.1,63.9 v36.2,64
  Bottom 0.813: v36.2,64 v57.1,64
DO_LED  (via drill 0.6 pad 1.02)
  Top 0.68: T1.3 25.02,15.72 v26.2,16.9
  Top 0.813: BBBLACK.71 56.53,18.73 v55,17.2
  Bottom 0.813: v26.2,16.9 26.5,17.2 v55,17.2
DO_MACHINE_POWER  (via drill 0.6 pad 1.02)
  Top 0.65: T3.3 11.29,12.51 11.7,12.1 11.7,8.12 T2.3
  Top 0.813: 11.7,12.1 12.6,13 v13.4,13 | v52.8,20.2 53.99,21.39 BBBLACK.69
  Bottom 0.813: v13.4,13 16.5,16.1 22.2,16.1 25.5,19.4 52,19.4 v52.8,20.2
DO_X_DIR
  Top 0.61: IC1.2 44.8,86.74 38.75,80.69 BBBLACK.12
DO_X_DIR_BUFF  (via drill 0.6 pad 1.02)
  Top 0.406: 77.3,96.3 v77.2,96.3
  Top 0.61: 77.3,96.3 70.5,89.5 70.5,85.7 70.27,85.47 IC1.3
  Bottom 0.813: X4.1 v77.2,96.3
DO_X_STEP
  Top 0.406: 42.6,77.4 42.6,73.86 BBBLACK.13
  Top 0.61: IC1.9 73.76,81.66 72.9,80.8 72.9,79.3 71.4,77.8 54.5,77.8 53.9,77.2 51.8,77.2 50.9,78.1 50.9,80.3 50.4,80.8 44.2,80.8 42.6,79.2 42.6,77.4
DO_X_STEP_BUFF  (via drill 0.6 pad 1.02)
  Top 0.61: IC1.8 76.41,80.39 76.42,80.4 v82.5,80.4
  Bottom 0.61: X3.1 90.8,65.4 89.4,66.8 89.4,75.6 84.6,80.4 v82.5,80.4
DO_Y_DIR
  Top 0.61: IC1.5 43.53,82.93 41.8,81.2 41.55,80.95 41.3,80.7 41.3,75.11 BBBLACK.14
DO_Y_DIR_BUFF  (via drill 0.6 pad 1.02)
  Top 0.61: v78.1,90.6 73.6,90.6 71.8,88.8 71.8,84.5 71.1,83.8 71.1,82.6 70.16,81.66 IC1.6
  Bottom 0.813: X4.3 93.73,86.2 87.1,86.2 82.8,90.5 78.2,90.5 v78.1,90.6
DO_Y_STEP
  Top 0.65: IC2.9 52.96,48.04 44.85,56.15 44.1,56.9 43.83,57.17 BBBLACK.15
DO_Y_STEP_BUFF  (via drill 0.6 pad 1.02)
  Top 0.61: v80.7,55.4 v68.4,55.4
  Top 0.65: v58.9,55.4 58.9,49.7 59.3,49.3 61.02,49.3 IC2.8
  Bottom 0.61: X3.3 v80.7,55.4
  Bottom 0.65: v68.4,55.4 v58.9,55.4
DO_Z_DIR  (via drill 0.6 pad 1.02)
  Top 0.61: BBBLACK.18 46.37,77.87 47.5,79 v48.9,79 | v53.4,79 70,79 71.3,80.3 71.3,81.1 72.5,82.3 72.5,83.5 73,84 73,85 73.47,85.47 IC1.12
  Bottom 0.61: v48.9,79 v53.4,79
DO_Z_DIR_BUFF  (via drill 0.6 pad 1.02)
  Top 0.61: IC1.11 78.6,84.2 80,85.6 83.6,85.6 v83.7,85.5
  Bottom 0.813: v83.7,85.5 92.9,76.3 X4.5
DO_Z_STEP
  Top 0.65: BBBLACK.19 48.91,68.59 63.7,53.8 63.7,48.3 65.23,46.77 IC2.5
DO_Z_STEP_BUFF  (via drill 0.6 pad 1.02)
  Top 0.61: v80,45.3 79.3,45.3 79.2,45.4
  Top 0.65: IC2.6 76.56,48.04 79.2,45.4
  Bottom 0.61: X3.5 80.1,45.4 v80,45.3
GND  (via drill 0.6 pad 1.02)
  Top 0.61: T4.2 1.16,14.74 0.9,15 0.9,17.86 T5.2
  other vias: 27.3,12 24.1,31.2 51.4,38 30.1,31.6 53.1,33.2 70,31.2 97.4,47.7 60.8,19.1 82.8,19.2 68,67 85.6,67.9 53.7,68.7 11.1,39.8 23.3,40.6 28.1,84.6 23.2,80.4 97.3,17 97.3,31.9 97.1,93.8 97.7,83.9 97.5,58.1 32.4,56.9 10.8,25 15.2,95.8 52.9,92.9 61.2,81 77.6,82.2 72.3,51.7 37.2,45.9 31.4,5.9 61.3,84.9 74.8,78.3 77.9,59.5 77.3,51.7 24.2,76.1 27,2.8 8.4,3.9 50.3,21.7 30.1,15.5 25,7.3 51.5,57.31 41.24,56.69 13.24,16.47
  pour Bottom (isolate 0.406): 0,100 100,100 100,0 0,0
  pour Top (isolate 0.406): 0,100 100,100 100,0 0,0
I_MACHINE_POWER  (via drill 0.6 pad 1.02)
  Top 0.406: T3.1 10.32,15.43
  Top 0.61: LED3.C 29.55,12.25 28.2,13.6 28.2,18.2 27.5,18.9 v21.8,18.9 12.4,18.9 10.3,16.8 10.3,15.55 R6.1
  Top 0.65: IC2.10 62.83,46.77 64.1,45.5 64.1,36.7 | 10.32,15.43 R6.1
  Top 0.68: 64.1,36.7 64.1,33.1 v61.8,30.8
  Bottom 0.68: v61.8,30.8 49.1,30.8 47.4,29.1 23.3,29.1 21.8,27.6 v21.8,18.9
I_MACHINE_POWER1  (via drill 0.6 pad 1.02)
  Top 0.61: v21.7,11.9 23.45,10.15 LED4.C 23.25,8.6 R8.1 | v6.3,14.4 6.6,14.4 | 8.88,13.2 T3.2 | T2.2 9.18,7.9 R4.1 7.45,6.65 v6.6,5.8
  Top 0.65: 9.32,12.72 T3.2 9.36,11.76 9.2,11.6 9.2,7.88 T2.2 | 8.88,13.2 8.88,13.22 8.2,13.9 6.8,13.9 v6.3,14.4
  Bottom 0.61: v6.6,5.8 6.3,5.8 5.5,5 5.5,3.17 JP2.1
  Bottom 0.813: v21.7,11.9 16.3,11.9 15,10.6 10.1,10.6 v6.3,14.4
N$1
  Top 0.65: LED1.C 15.6,12.76 T1.1
N$2
  Top 0.65: R1.1 LED1.A
N$3
  Top 0.65: LED2.A 20.65,6 R2.1
N$5  (via drill 0.6 pad 1.02)
  Top 0.61: T2.1 10.32,4.08 v11.5,2.9
  Bottom 0.61: v11.5,2.9 JP1.1
N$8
  Top 0.61: 4.9,12.2 4.9,12.21 T4.3 3.09,15.12 T5.1
  Top 0.65: R3.1 4.9,12.2
N$9  (via drill 0.6 pad 1.02)
  Top 0.61: T4.1 2.12,6.88 v3,6
  Bottom 0.61: v3,6 3,3.13 JP2.2
N$10
  Top 0.813: LED3.A 32,9.15 R5.1
N$12
  Top 0.61: LED4.A 26.55,8.8 R7.1
VDD_5V
  Top 1.27: BBBLACK.51 BBBLACK.52

### Text on the board
tPlace: X-Max/Min / -+ -+ | Y-Max/Min / -+ -+ | top | DIR_X / - + | + - / AUX-Out | DIR_Y / - + | DIR_Z / - + | ST_X / - + | ST_Y / - + | ST_Z / - + | Reset | Z-Probe / -+ | EN_X / - + | EN_Y / - + | EN_Z / - + | -+ -+ / Z-Max/Min | BBB_CNC V2 / Armin Schlegel 08.07.2014
bPlace: bot